# Altium schematic sheet 13-UART_CAN_IO.SchDoc
size B
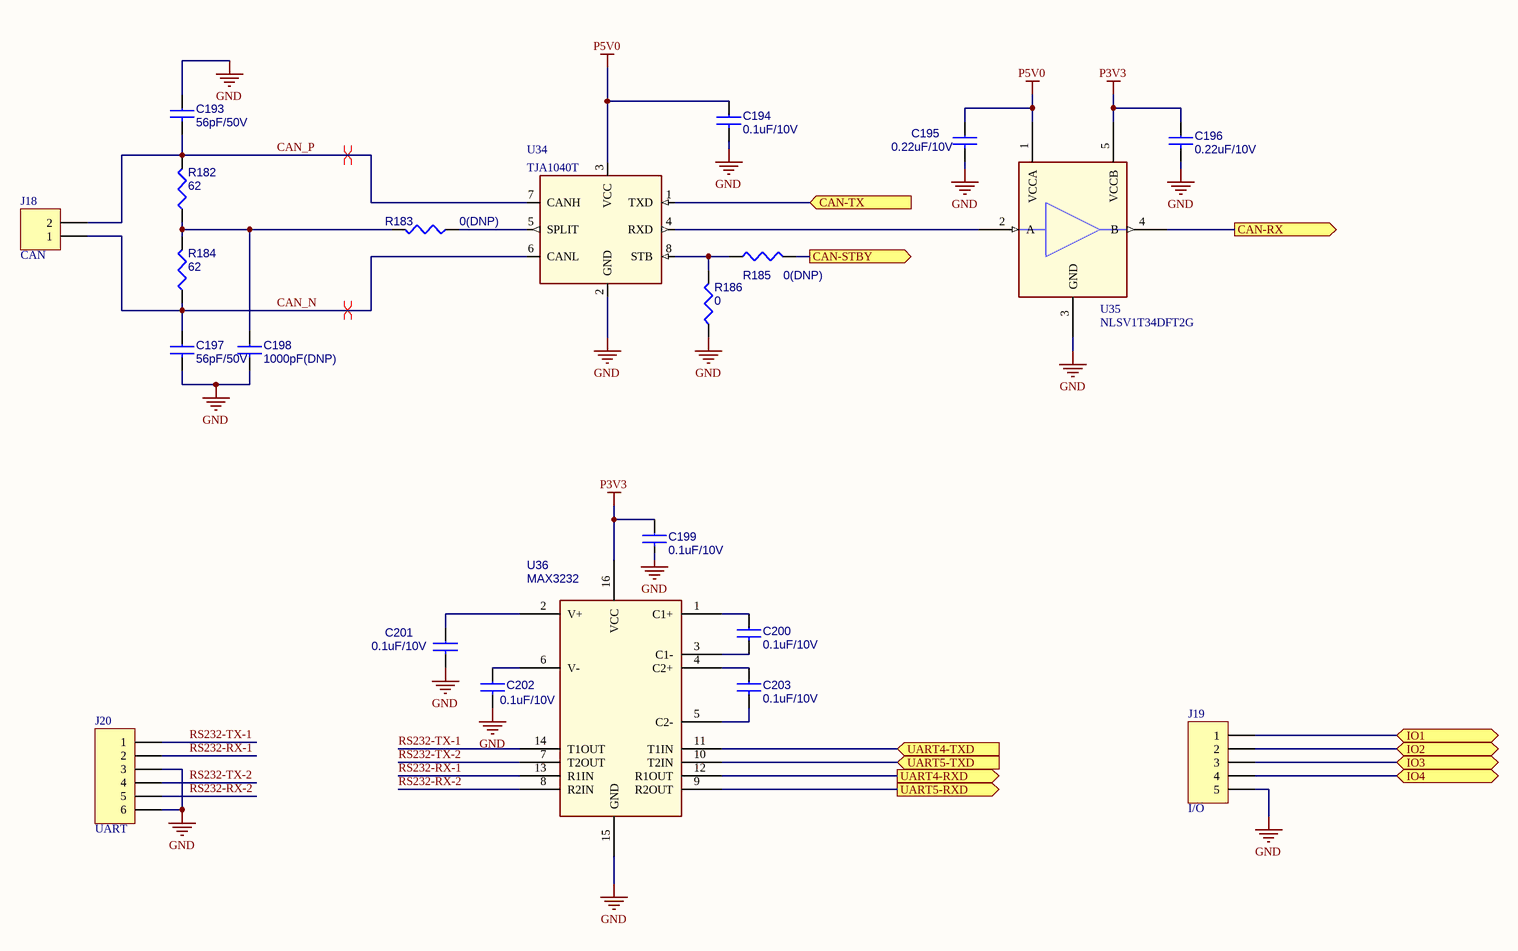
[diagram p0: 13-UART_CAN_IO.SchDoc]

## Parts
C193  56pF/50V  [0603]
C194  0.1uF/10V  [0402]
C195  0.22uF/10V  [0402]
C196  0.22uF/10V  [0402]
C197  56pF/50V  [0603]
C198  1000pF(DNP)  [0603]
C199  0.1uF/10V  [0402]
C200  0.1uF/10V  [0402]
C201  0.1uF/10V  [0402]
C202  0.1uF/10V  [0402]
C203  0.1uF/10V  [0402]
J18  CAN  [CON-2PIN]
J19  I/O  [CON-5PIN]
J20  UART  [CON-6PIN]
R182  62  [0402]
R183  0(DNP)  [0402]
R184  62  [0402]
R185  0(DNP)  [0402]
R186  0  [0402]
U34  TJA1040T  [SO8]
U35  NLSV1T34DFT2G  [SC70]
U36  MAX3232  [SO-16]

## Ports
CAN-RX (out), CAN-STBY (out), CAN-TX (in), IO1 (bidir), IO2 (bidir), IO3 (bidir), IO4 (bidir), UART4-RXD (out), UART4-TXD (in), UART5-RXD (out), UART5-TXD (in)

## Nets
GND: C193.1 C194.2 C195.2 C196.2 C197.2 C198.2 C199.2 C201.2 C202.2 J19.5 J20.3 J20.6 R186.2 U34.2(GND) U35.3(GND) U36.15(GND)
P3V3: C196.1 C199.1 U35.5(VCCB) U36.16(VCC)
P5V0: C194.1 C195.1 U34.3(VCC) U35.1(VCCA)
CAN-RX: U35.4(B) ; port CAN-RX
CAN-STBY: R185.1 ; port CAN-STBY
CAN-TX: U34.1(TXD) ; port CAN-TX
CAN_N: C197.1 J18.1 R184.2 U34.6(CANL)
CAN_P: C193.2 J18.2 R182.1 U34.7(CANH)
IO1: J19.1 ; port IO1
IO2: J19.2 ; port IO2
IO3: J19.3 ; port IO3
IO4: J19.4 ; port IO4
RS232-RX-1: J20.2 U36.13(R1IN)
RS232-RX-2: J20.5 U36.8(R2IN)
RS232-TX-1: J20.1 U36.14(T1OUT)
RS232-TX-2: J20.4 U36.7(T2OUT)
UART4-RXD: U36.12(R1OUT) ; port UART4-RXD
UART4-TXD: U36.11(T1IN) ; port UART4-TXD
UART5-RXD: U36.9(R2OUT) ; port UART5-RXD
UART5-TXD: U36.10(T2IN) ; port UART5-TXD
NetC198_1: C198.1 R182.2 R183.1 R184.1
NetC200_1: C200.1 U36.1(C1+)
NetC200_2: C200.2 U36.3(C1-)
NetC201_1: C201.1 U36.2(V+)
NetC202_1: C202.1 U36.6(V-)
NetC203_1: C203.1 U36.4(C2+)
NetC203_2: C203.2 U36.5(C2-)
NetR183_2: R183.2 U34.5(SPLIT)
NetR185_2: R185.2 R186.1 U34.8(STB)
NetU34_4: U34.4(RXD) U35.2(A)

## Layout directives
differential pair: CAN_N, CAN_P

## Library data of the parts
C193-C198 = P_CAP NP
C199-C203 = CAP
J18 = Header 2: Header, 2-Pin; LatestRevisionDate: 17-Jul-2002; LatestRevisionNote: Re-released for DXP Platform.; Publisher: Altium Limited
J19 = Header 5: Header, 5-Pin; LatestRevisionDate: 17-Jul-2002; LatestRevisionNote: Re-released for DXP Platform.; Publisher: Altium Limited
J20 = Header 6: Header, 6-Pin; LatestRevisionDate: 17-Jul-2002; LatestRevisionNote: Re-released for DXP Platform.; Publisher: Altium Limited
R182-R186 = P_R
U34 = TJA1040T_SO_8P: IC XCVR CAN HS 5V SO8; CAD_APPROVED: Yes; MFG_NAME01: NXP SEMICONDUCTORS; AGILE_PN: 312-79676; CLASS: IC; HEIGHT: 1.75 MM; ROHS: Yes; MFG_PN01: TJA1040T